# EasyEDA Pro project flag.epro

# Board PCB4
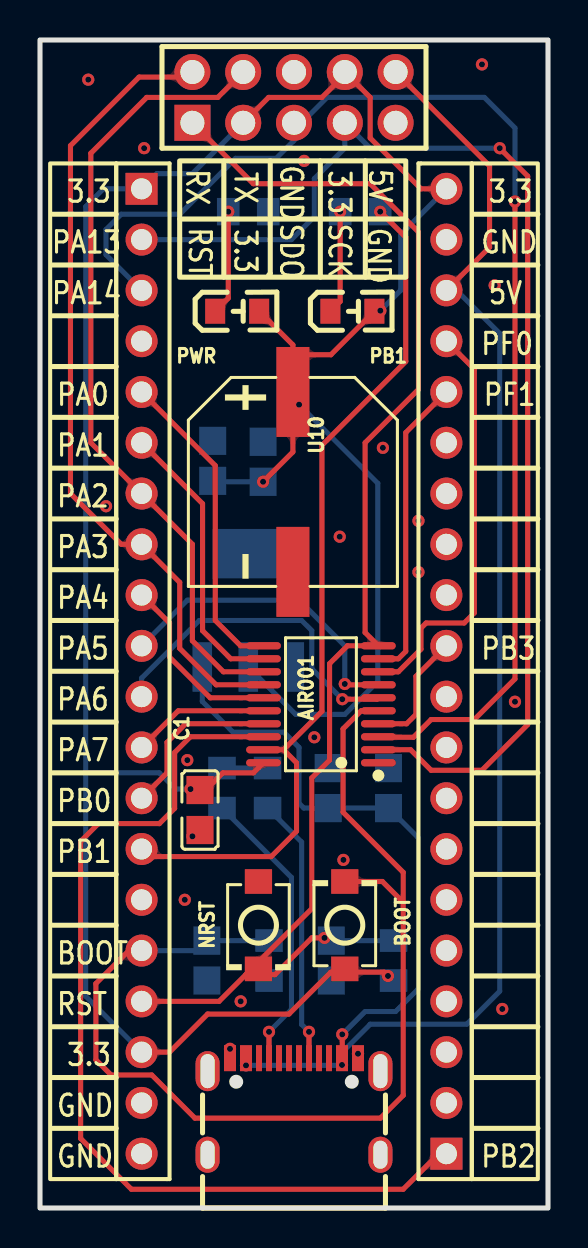
[diagram p0: board, top side]
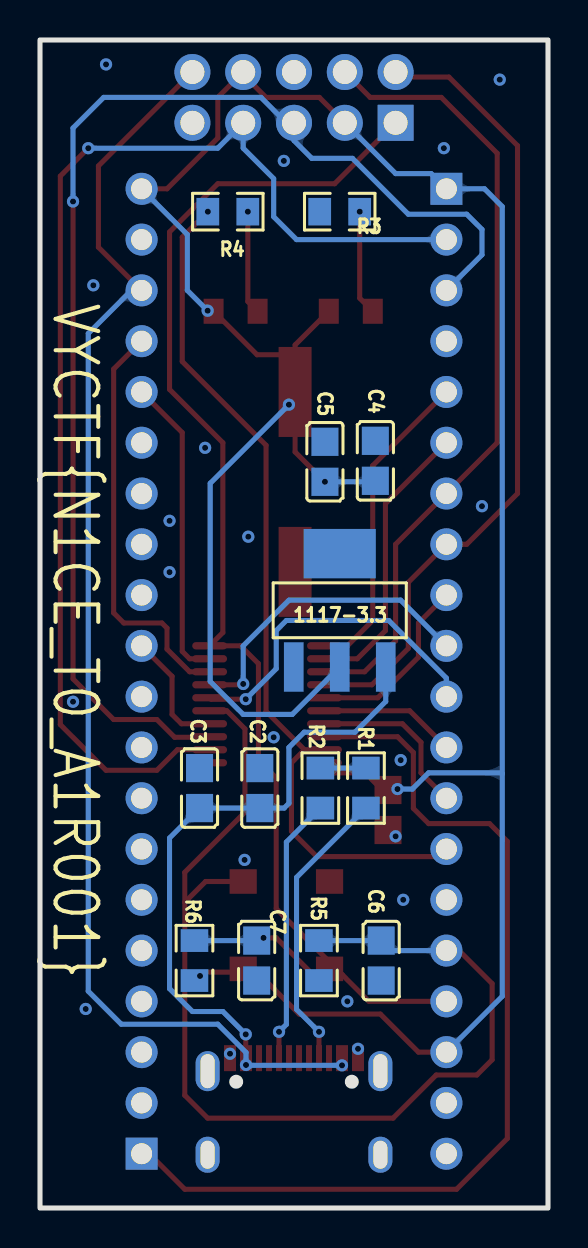
[diagram p1: board, bottom side, seen from below]

Outline 25.4 x 58.42 mm; copper layers: Top Layer, Bottom Layer. Coordinates in mm from the lower left corner of the outline.
Outline path: rectangle 0,58.42 25.4,0
Stack: Top Layer 0.035mm / Dielectric1 1.51mm FR4 er 4.5 / Bottom Layer 0.035mm

## Design rules (mm)
template: JLCPCB Capability(Two Layers Board)
spacing copperThickness1oz (default): track to track 0.102, other pairs 0.152 to 0.3
spacing copperThickness2oz: track to track 0.203, other pairs 0.152 to 0.3
track width copperThickness1oz (default): min 0.127, default 0.254, max 2.54
track width copperThickness2oz: min 0.203, default 0.254, max 2.54
differential pair differentialPair (default): width min 0.127, default 0.254, max 2.54; gap min 0.152, default 0.152
via viaSize (default): diameter min 0.5, default 0.61, max 10; hole min 0.3, default 0.305, max 6.3

## Placement (name value [footprint] x y rotation side)
1117-3.3  AMS1117-3.3  [SOT-223-4_L6.5-W3.5-P2.30-LS7.0-BR]  10.41 29.89 270 bottom
AIR001  AIR001  [TSSOP-20_L6.5-W4.4-P0.65-LS6.4-BL]  14.05 25.2 90 top
BOOT  TS-1088-AR02016  [SW-SMD_L3.9-W3.0-P4.45]  15.24 14.15 90 top
C1  100nF  [C0805]  8 19.91 270 top
C2  100nF  [C0805]  14.41 21 270 bottom
C3  10uF  [C0805]  17.42 21 270 bottom
C4  100nF  [C0805]  8.63 37.37 270 bottom
C5  10uF  [C0805]  11.15 37.32 270 bottom
C6  100nF  [C0805]  8.34 12.38 90 bottom
C7  100nF  [C0805]  14.57 12.38 90 bottom
H1  2.54-1*20  [HDR-TH_20P-P2.54-V-M]  5.08 26.85 270 top
H2  2.54-1*20  [HDR-TH_20P-P2.54-V-M]  20.32 26.85 90 top
NRST  TS-1088-AR02016  [SW-SMD_L3.9-W3.0-P4.45]  10.92 14.15 270 top
PB1  NCD0805R1  [LED0805-RD_RED]  15.62 44.85 0 top
PWR  NCD0805R1  [LED0805-RD_RED]  9.86 44.85 0 top
R1  5.1kΩ  [R0805]  9.1 21 270 bottom
R2  5.1kΩ  [R0805]  11.38 21 90 bottom
R3  5.1kΩ  [R0805]  10.41 49.83 0 bottom
R4  5.1kΩ  [R0805]  16.01 49.83 180 bottom
R5  10kΩ  [R0805]  11.45 12.38 270 bottom
R6  10kΩ  [R0805]  17.68 12.38 270 bottom
U10  330uF  [CAP-SMD_BD10.0-L10.3-W10.3-FD]  12.65 36.32 270 top
U12  A2541WV-2x5P  [HDR-TH_10P-P2.54-V-M-R2-C5-S2.54-1]  12.7 55.55 0 top
USB1  KH-TYPE-C-16P  [USB-C-SMD_KH-TYPE-C-16P]  12.7 5.08 0 top

## Footprints (pads in the part's own frame, mm; a bottom-side part is the same pattern mirrored in y, then rotated)
C0805
  rect 1.41x1.35 smd: 1(-1,0) 2(1,0)
CAP-SMD_BD10.0-L10.3-W10.3-FD
  rect 4.5x1.65 smd: 1(-4.5,0) 2(4.5,0)
HDR-TH_10P-P2.54-V-M-R2-C5-S2.54-1
  rect 1.8x1.8 hole 1.2: 1(-5.08,-1.27)
  round 1.8 hole 1.2: 2(-5.08,1.27) 3(-2.54,-1.27) 4(-2.54,1.27) 5(0,-1.27) 6(0,1.27) 7(2.54,-1.27) 8(2.54,1.27) 9(5.08,-1.27) 10(5.08,1.27)
HDR-TH_20P-P2.54-V-M
  rect 1.6x1.6 hole 1.05: 1(-24.13,0)
  round 1.6 hole 1.05: 2(-21.59,0) 3(-19.05,0) 4(-16.51,0) 5(-13.97,0) 6(-11.43,0) 7(-8.89,0) 8(-6.35,0) 9(-3.81,0) 10(-1.27,0) 11(1.27,0) 12(3.81,0) 13(6.35,0) 14(8.89,0) 15(11.43,0) 16(13.97,0) 17(16.51,0) 18(19.05,0) 19(21.59,0) 20(24.13,0)
LED0805-RD_RED
  rect 1x1.25 smd: 1(-1.1,0) 2(1.1,0)
R0805
  rect 1.133x1.377 smd: 1(-1,0) 2(1,0)
SOT-223-4_L6.5-W3.5-P2.30-LS7.0-BR
  rect 2.47x0.98 smd: 1(2.835,-2.3) 2(2.835,0) 3(2.835,2.3)
  rect 2.47x3.6 smd: 4(-2.835,0)
SW-SMD_L3.9-W3.0-P4.45
  rect 1.23x1.36 smd: 1(-2.185,0) 2(2.185,0)
TSSOP-20_L6.5-W4.4-P0.65-LS6.4-BL
  oval 0.364x1.742 smd: 1(-2.925,-2.871) 2(-2.275,-2.871) 3(-1.625,-2.871) 4(-0.975,-2.871) 5(-0.325,-2.871) 6(0.325,-2.871) 7(0.975,-2.871) 8(1.625,-2.871) 9(2.275,-2.871) 10(2.925,-2.871) 11(2.925,2.871) 12(2.275,2.871) 13(1.625,2.871) 14(0.975,2.871) 15(0.325,2.871) 16(-0.325,2.871) 17(-0.975,2.871) 18(-1.625,2.871) 19(-2.275,2.871) 20(-2.925,2.871)
USB-C-SMD_KH-TYPE-C-16P
  oval 1.2x2 hole 0.7x1.7: 1(-4.32,1.765) 2(4.32,1.765)
  oval 1.2x1.8 hole 0.7x1.4: 3(-4.32,-2.415) 4(4.32,-2.415)
  rect 0.3x1.3 smd: A1(-3.35,2.415) A4(-2.55,2.415) A5(-1.25,2.415) A6(-0.25,2.415) A7(0.25,2.415) A8(1.25,2.415) A9(2.55,2.415) A12(3.35,2.415) B1(3.05,2.415) B4(2.25,2.415) B5(1.75,2.415) B6(0.75,2.415) B7(-0.75,2.415) B8(-1.75,2.415) B9(-2.25,2.415) B12(-3.05,2.415)

## Nets
3V3: 1117-3.3.2 AIR001.20 BOOT.1 C1.1 C4.2 C5.2 H1.1 H1.18 H2.20 PB1.2 PWR.2 R6.2 U10.1 U12.3 U12.8
GND: 1117-3.3.1 AIR001.1 C1.2 C2.1 C3.1 C4.1 C5.1 C6.1 C7.1 H1.19 H1.20 H2.19 NRST.1 R1.1 R2.2 R3.2 R5.2 U10.2 U12.6 U12.9 USB1.A1 USB1.A12 USB1.B1 USB1.B12
VBUS: 1117-3.3.3 C2.2 C3.2 H2.18 U12.10 USB1.A4 USB1.A9 USB1.B4 USB1.B9
BOOT0: AIR001.5 BOOT.2 C6.2 H1.16 R5.1
NRST: AIR001.10 C7.2 H1.17 NRST.2 R6.1 U12.1
PA0: AIR001.11 H1.5
PA1: AIR001.12 H1.6
PA2: AIR001.13 H1.7 U12.4
PA3: AIR001.14 H1.8 U12.2
PA4: AIR001.15 H1.9
PA5: AIR001.7 H1.10
PA6: AIR001.6 H1.11
PA7: AIR001.16 H1.12
PA13: AIR001.2 H1.2 U12.7
PA14: AIR001.3 H1.3 U12.5
PB0: AIR001.17 H1.13
PB1: AIR001.19 H1.14 R4.1
PB2: AIR001.18 H2.1
PB3: AIR001.4 H2.11
PF0: AIR001.8 H2.17
PF1: AIR001.9 H2.16
$1N1468: R1.2 USB1.A5
$1N1470: R2.1 USB1.B6
$1N1503: PWR.1 R3.1
$1N1505: PB1.1 R4.2

Pads without a net: 1117-3.3 4; H1 4 15; H2 2 3 4 5 6 7 8 9 10 12 13 14 15; USB1 1 2 3 4 A6 A7 A8 B5 B7 B8

## Via types
v1: diameter 0.61, hole 0.305, Top Layer to Bottom Layer, 38 vias

## Routing (per net, layer and track width the routed paths; a pad name or vN(x,y) marks a point on that pad's centre or on a via; arc(x,y) is an arc through that point)
3V3: length 141.1
  Top Layer w0.254: U10.1 12.95,40.51 v1(12.95,40.18) ; U10.1 12.65,37.82 v1(11.15,36.32) ; U10.1 12.65,42.68 ; 12.65,42.68 14.55,42.68 PB1.2 16.99,44.85 v1(17.02,44.88) ; 12.65,42.68 12.65,43.17 PWR.2 ; H1.18 6.48,7.8 8.38,9.7 12.45,9.7 14.54,11.8 17.21,11.8 v1(17.4,11.61) ; AIR001.20 10.67,21.77 9.14,21.77 8.28,20.91 C1.1 ; H2.20 19.05,50.98 16.51,53.52 16.51,55.55 U12.8 15.24,56.69 14.1,55.55 11.43,55.55 U12.3
  Bottom Layer w0.254: 2.29,21.73 2.29,50.09 3.18,50.98 H1.1 5.84,51.74 7.62,51.74 U12.3 ; 2.29,21.73 2.29,10.59 H1.18 ; 2.29,21.73 2.33,21.77 5.97,21.77 6.78,20.95 v1(7.53,20.95) ; C4.2 8.68,36.32 v1(11.15,36.32) ; v1(17.4,11.61) 17.66,11.61 17.68,11.62 ; v1(12.95,40.18) 16.89,36.24 16.89,26.34 15.24,24.69 12.79,24.69 1117-3.3.2 ; H2.20 18.03,48.69 18.03,45.9 v1(17.02,44.88)
GND: length 2.3
  Bottom Layer w0.254: R2.2 R1.1
  vias: v1(2.41,56.44) v1(3.3,35.1) v1(5.21,53.01) v1(7.24,15.42) v1(7.37,22.4) v1(7.62,18.59) v1(9.5,7.96) v1(10.03,10.34) v1(13.21,52.37) v1(13.72,23.54) v1(14.99,33.58) v1(15.17,17.41) v1(15.9,7.72) v1(17.15,38.02) v1(18.92,34.37) v1(18.92,31.8) v1(22.1,57.2) v1(22.73,46.15) v1(23.11,9.96) v1(23.75,25.32)
VBUS: length 95.7
  Top Layer w0.254: U12.10 22.48,52.12 22.48,48.06 H2.18 ; 14.95,7.49 15.11,7.66 v1(15.11,8.69) ; USB1.A4 USB1.B9
  Bottom Layer w0.254: v1(15.11,8.69) 16.26,9.83 17.78,9.83 18.92,10.97 18.92,18.5 C3.2 C2.2 13.19,20 12.95,20.24 12.95,23.04 12.19,23.8 9.65,23.8 8.11,25.34 1117-3.3.3 ; v1(10.3,7.13) 15.08,7.13 v1(15.1,7.15) 15.1,7.78 16.51,9.19 21.34,9.19 22.99,10.84 22.99,43.74 20.83,45.9 H2.18
BOOT0: length 55.6
  Top Layer w0.254: H1.16 4.44,12.88 2.79,11.23 2.79,7.41 3.56,6.65 5.59,6.65 7.75,4.49 17.02,4.49 18.16,5.64 18.16,15.29 ; BOOT.2 17.12,16.33 18.16,15.29 ; 18.16,15.29 18.16,16.79 15.15,19.8 15.15,23.97 16.06,24.87 AIR001.5
  Bottom Layer w0.254: 11.45,13.13 11.21,13.38 C6.2 7.84,12.88 H1.16
NRST: length 69.8
  Top Layer w0.254: 10.29,11.67 8.95,10.34 H1.17 ; 10.29,11.67 11.75,11.67 13.59,13.51 v1(14.22,13.51) ; 10.29,11.67 13.59,14.97 13.59,21.51 14.48,22.4 14.48,27.23 15.37,28.12 AIR001.10 16.26,28.78 16.26,38.28 18.92,40.94 18.92,48.82 16.51,51.23 10.67,51.23 U12.1
  Bottom Layer w0.254: v1(14.22,13.51) 14.43,13.51 C7.2 17.43,13.38 17.68,13.13
PA0: length 15.9
  Top Layer w0.254: AIR001.11 10.03,28.12 8.76,29.39 8.76,37.13 H1.5
PA1: length 14.3
  Top Layer w0.254: H1.6 8.13,35.23 8.13,28.88 9.54,27.47 AIR001.12
PA2: length 40
  Top Layer w0.254: AIR001.13 9.17,26.82 7.62,28.37 7.62,33.2 H1.7 2.54,38.28 2.54,52.75 5.33,55.55 8.89,55.55 U12.4
PA3: length 40.6
  Top Layer w0.254: AIR001.14 8.8,26.17 6.99,27.99 6.99,31.29 H1.8 4.06,33.2 1.52,35.74 1.52,53.14 4.95,56.56 7.37,56.56 U12.2
PA4: length 9.2
  Top Layer w0.254: H1.9 6.48,29.26 6.48,27.55 8.51,25.52 AIR001.15
PA5: length 15.7
  Top Layer w0.254: v1(15.24,26.21) 15.28,26.17 AIR001.7
  Bottom Layer w0.254: H1.10 7.37,30.4 12.95,30.4 15.24,28.12 v1(15.24,26.21)
PA6: length 16.7
  Top Layer w0.254: v1(15.11,25.45) 16.85,25.45 AIR001.6
  Bottom Layer w0.254: H1.11 5.08,26.5 7.96,29.39 13.08,29.39 13.59,28.88 13.59,26.97 v1(15.11,25.45)
PA7: length 6.9
  Top Layer w0.254: H1.12 6.91,24.87 AIR001.16
PA13: length 61
  Top Layer w0.254: AIR001.2 18.53,22.92 19.56,21.89 22.1,21.89 24.38,24.18 24.38,51.61 v1(22.99,53.01)
  Bottom Layer w0.254: H1.2 12.57,48.44 13.72,49.58 13.72,51.48 15.24,53.01 U12.7 16.51,53.01 v1(22.99,53.01)
PA14: length 63.7
  Top Layer w0.254: AIR001.3 16.94,23.54 18.67,23.54 19.56,24.43 21.72,24.43 23.75,26.47 v1(23.75,50.34)
  Bottom Layer w0.254: H1.3 3.3,47.67 3.3,48.94 4.06,49.71 6.99,49.71 9.78,52.5 11.81,52.5 12.7,53.39 U12.5 13.08,54.28 14.35,55.55 22.22,55.55 23.75,54.02 v1(23.75,50.34)
PB0: length 8.5
  Top Layer w0.254: AIR001.17 7.28,24.22 6.35,23.29 6.35,21.77 H1.13
PB1: length 43.7
  Top Layer w0.254: 12.17,22.92 14.1,24.84 14.1,38.15 18.29,42.34 18.29,48.55 v1(17.01,49.83) ; 12.17,22.92 12.83,22.27 12.83,18.84 11.56,17.58 5.46,17.58 H1.14 ; 12.17,22.92 AIR001.19
PB2: length 47.9
  Top Layer w0.254: AIR001.18 7.52,23.57 6.73,22.78 6.73,19.99 5.97,19.23 2.92,19.23 2.03,18.34 2.03,3.48 4.57,0.94 18.16,0.94 19.94,2.72 H2.1
PB3: length 6.1
  Top Layer w0.254: AIR001.4 18.33,24.22 18.8,24.69 18.8,26.59 H2.11
PF0: length 20.8
  Top Layer w0.254: H2.17 21.72,41.96 21.72,29.77 21.21,29.26 19.3,29.26 19.05,29.01 19.05,27.95 17.92,26.82 AIR001.8
PF1: length 15.3
  Top Layer w0.254: AIR001.9 17.92,27.47 18.29,27.84 18.29,38.78 H2.16
$1N1468: length 14.4
  Top Layer w0.254: USB1.A5 v1(11.45,8.81)
  Bottom Layer w0.254: v1(11.45,8.81) 12.57,9.94 12.57,16.53 R1.2
$1N1470: length 13.4
  Top Layer w0.254: USB1.B6 v1(13.45,8.81)
  Bottom Layer w0.254: v1(13.45,8.81) 13.08,9.18 13.08,18.31 R2.1
$1N1503: length 5.3
  Top Layer w0.254: PWR.1 9.41,45.51 v1(9.41,49.83)
$1N1505: length 5.2
  Top Layer w0.254: v1(15.01,49.83) 15.01,45.34 14.52,44.85

## Copper pours and planes (outline as drawn; the poured copper is in the pictures)
GND on Top Layer: -3.81,64.31 30.99,64.31 30.99,-4.65 -3.81,-4.65
GND on Bottom Layer: -9.02,67.49 35.56,67.49 35.56,-10.24 -9.02,-10.24

Small or netless copper shapes (teardrops, artwork), in the pictures only: 74 on Top Layer, 47 on Bottom Layer

## Text on the board
Bottom Silkscreen Layer: VYCTF{N1CE_T0_A1R001}
Top Silkscreen Layer: RX | RST | TX | 3.3 | GND | SDO | SCK | 5V | PA13 | PA14 | PA0 | PA1 | PA2 | PA3 | PA4 | PA5 | PA6 | PA7 | PB0 | PB1 | BOOT | PF0 | PB3 | PB2 | PF1
